# Altium schematic sheet Multiplexage_Matrices.SchDoc
size A3; Author: Jérémie Jean-Elie; Organization: ETML-ES; Address1: Avenue Recordon 1; Address2: 1004 Lausanne; Address3: Switzerland; Revision: 1; SheetNumber: 3; SheetTotal: 7; Version: E
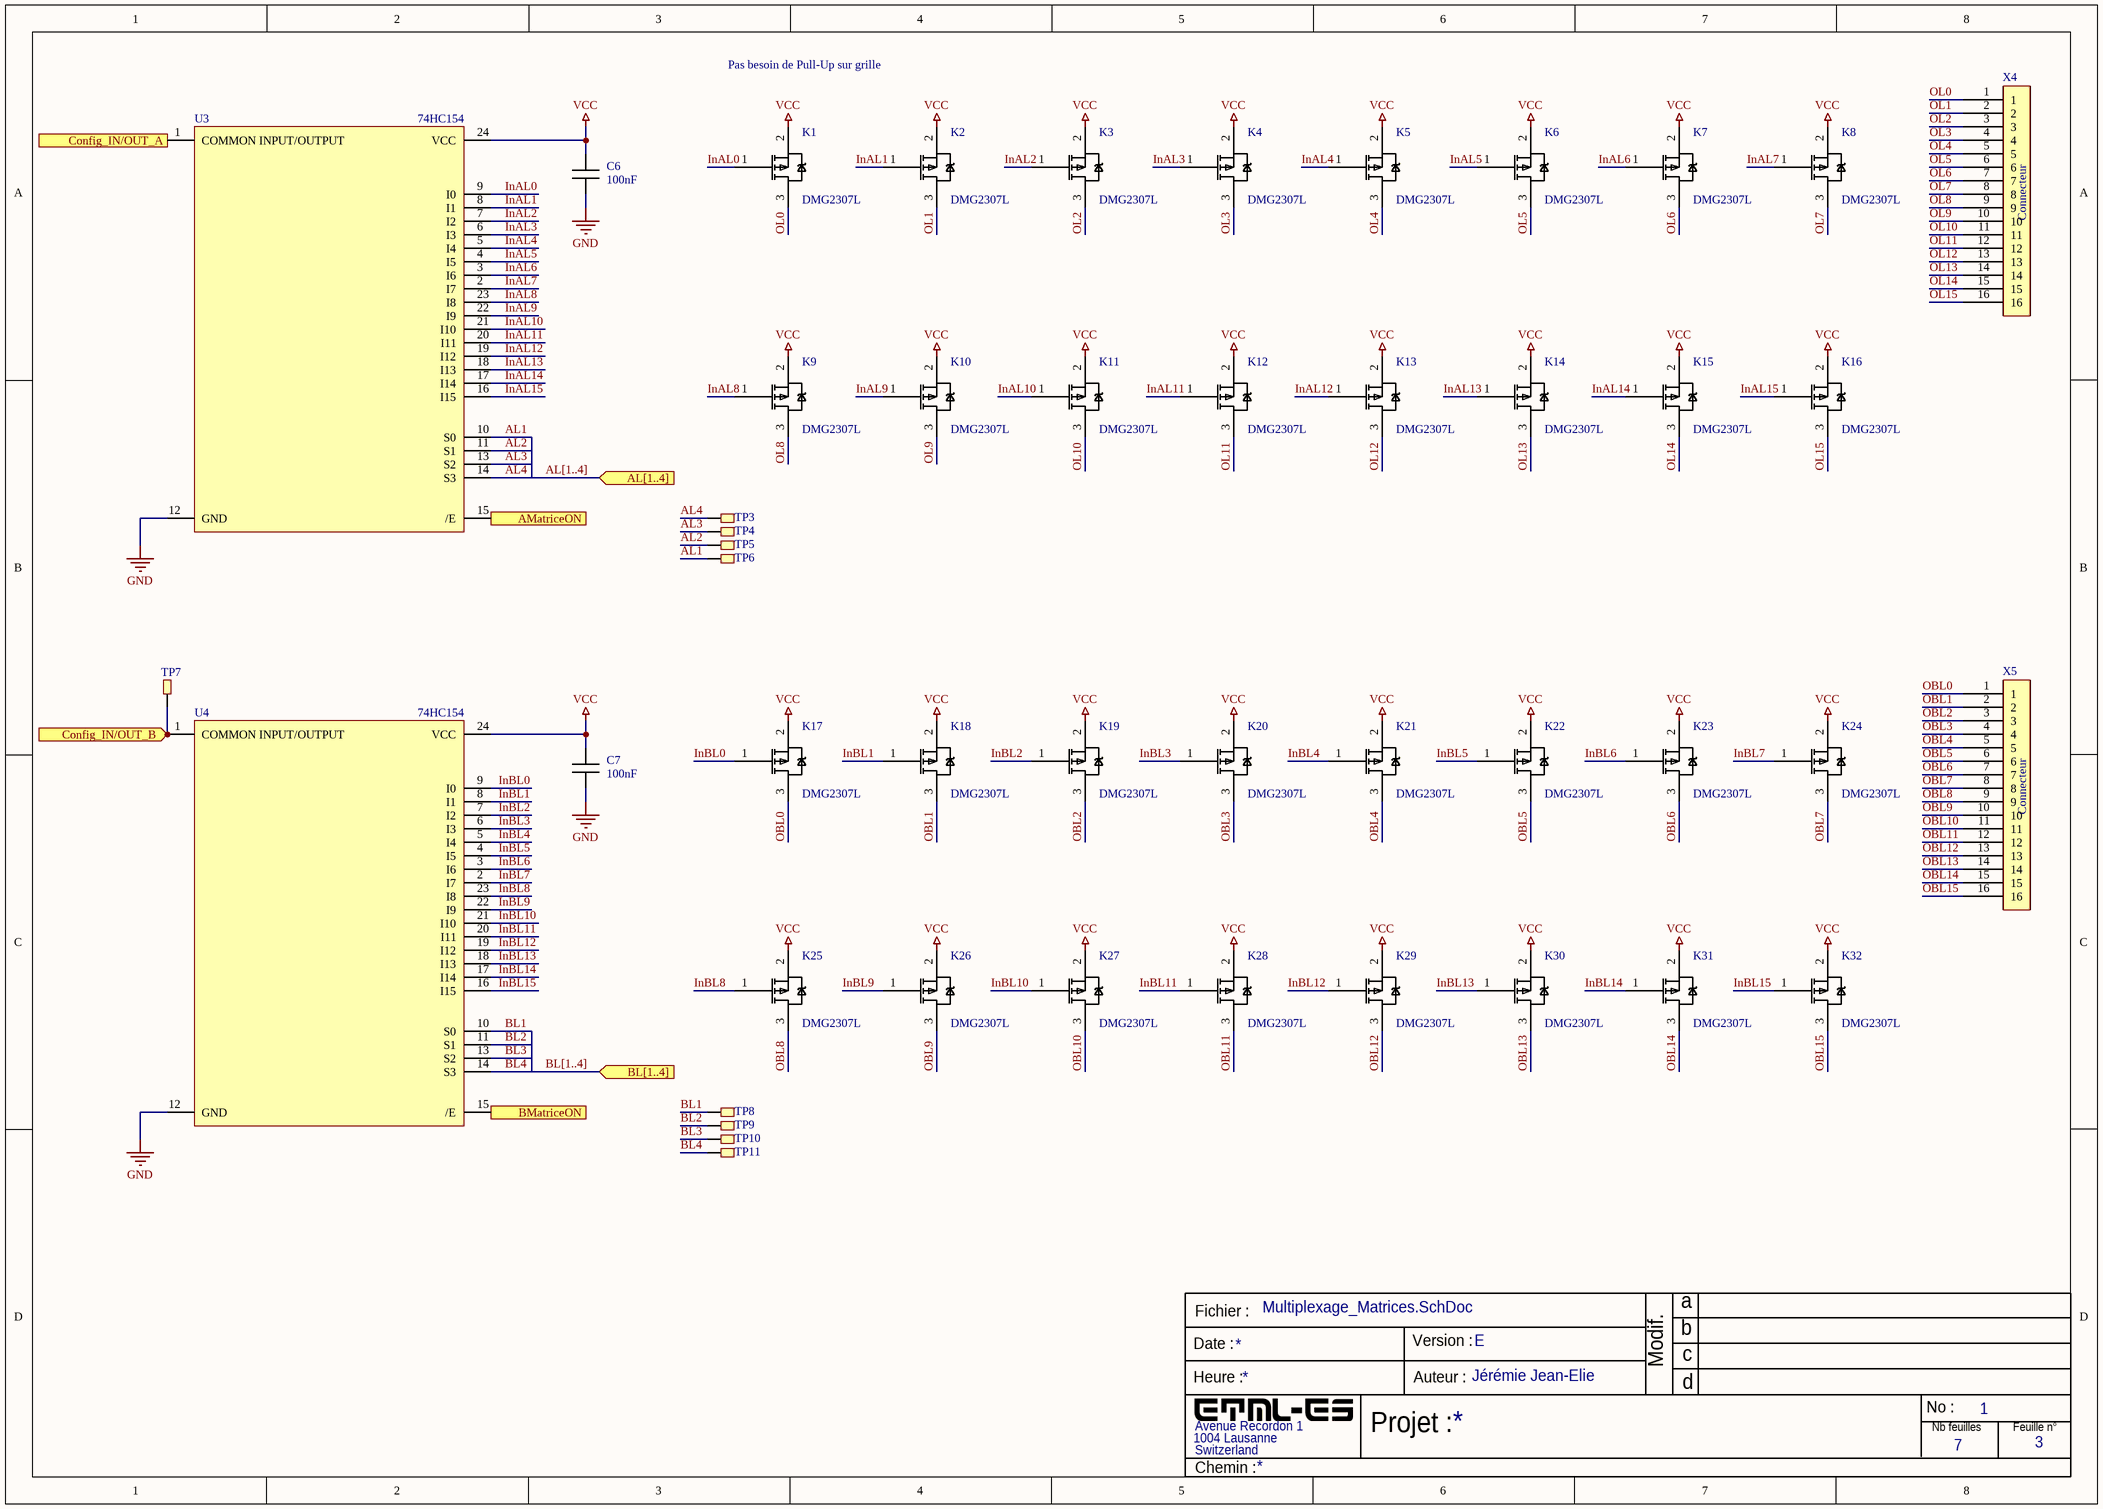
[diagram p0: Multiplexage_Matrices.SchDoc]

## Parts
C6  100nF  [CAPC1608X08M]
C7  100nF  [CAPC1608X08M]
K1  DMG2307L  [SOT90P240X110-3M]
K2  DMG2307L  [SOT90P240X110-3M]
K3  DMG2307L  [SOT90P240X110-3M]
K4  DMG2307L  [SOT90P240X110-3M]
K5  DMG2307L  [SOT90P240X110-3M]
K6  DMG2307L  [SOT90P240X110-3M]
K7  DMG2307L  [SOT90P240X110-3M]
K8  DMG2307L  [SOT90P240X110-3M]
K9  DMG2307L  [SOT90P240X110-3M]
K10  DMG2307L  [SOT90P240X110-3M]
K11  DMG2307L  [SOT90P240X110-3M]
K12  DMG2307L  [SOT90P240X110-3M]
K13  DMG2307L  [SOT90P240X110-3M]
K14  DMG2307L  [SOT90P240X110-3M]
K15  DMG2307L  [SOT90P240X110-3M]
K16  DMG2307L  [SOT90P240X110-3M]
K17  DMG2307L  [SOT90P240X110-3M]
K18  DMG2307L  [SOT90P240X110-3M]
K19  DMG2307L  [SOT90P240X110-3M]
K20  DMG2307L  [SOT90P240X110-3M]
K21  DMG2307L  [SOT90P240X110-3M]
K22  DMG2307L  [SOT90P240X110-3M]
K23  DMG2307L  [SOT90P240X110-3M]
K24  DMG2307L  [SOT90P240X110-3M]
K25  DMG2307L  [SOT90P240X110-3M]
K26  DMG2307L  [SOT90P240X110-3M]
K27  DMG2307L  [SOT90P240X110-3M]
K28  DMG2307L  [SOT90P240X110-3M]
K29  DMG2307L  [SOT90P240X110-3M]
K30  DMG2307L  [SOT90P240X110-3M]
K31  DMG2307L  [SOT90P240X110-3M]
K32  DMG2307L  [SOT90P240X110-3M]
TP3  TestPoint  [KEYSTONE_5019]  (value not drawn)
TP4  TestPoint  [KEYSTONE_5019]  (value not drawn)
TP5  TestPoint  [KEYSTONE_5019]  (value not drawn)
TP6  TestPoint  [KEYSTONE_5019]  (value not drawn)
TP7  5019  [KEYSTONE_5019]  (value not drawn)
TP8  TestPoint  [KEYSTONE_5019]  (value not drawn)
TP9  TestPoint  [KEYSTONE_5019]  (value not drawn)
TP10  TestPoint  [KEYSTONE_5019]  (value not drawn)
TP11  TestPoint  [KEYSTONE_5019]  (value not drawn)
U3  74HC154  [SOP127P1030X265-24N]
U4  74HC154  [SOP127P1030X265-24N]
X4  (no value)  [MOLEX_2x8]
X5  (no value)  [MOLEX_2x8]

## Ports
AL[1..4] (in, see Schema_bloc[2B], Microcontroleur[1B]), AMatriceON (in, see Schema_bloc[2C], Microcontroleur[1C]), BL[1..4] (in, see Schema_bloc[2B], Microcontroleur[1B]), BMatriceON (in, see Schema_bloc[2C], Microcontroleur[1C]), Config_IN/OUT_A (in, see Schema_bloc[2B], Microcontroleur[1B]), Config_IN/OUT_B (in, see Schema_bloc[2C], Microcontroleur[1C])

## Nets
GND: C6.1 C7.1 U3.12(GND) U4.12(GND)
VCC: C6.2 C7.2 K1.2(S) K2.2(S) K3.2(S) K4.2(S) K5.2(S) K6.2(S) K7.2(S) K8.2(S) K9.2(S) K10.2(S) K11.2(S) K12.2(S) K13.2(S) K14.2(S) K15.2(S) K16.2(S) K17.2(S) K18.2(S) K19.2(S) K20.2(S) K21.2(S) K22.2(S) K23.2(S) K24.2(S) K25.2(S) K26.2(S) K27.2(S) K28.2(S) K29.2(S) K30.2(S) K31.2(S) K32.2(S) U3.24(VCC) U4.24(VCC)
AL1: TP6.1 U3.10(S0)
AL2: TP5.1 U3.11(S1)
AL3: TP4.1 U3.13(S2)
AL4: TP3.1 U3.14(S3)
AMatriceON: U3.15(/E) ; port AMatriceON
BL1: TP8.1 U4.10(S0)
BL2: TP9.1 U4.11(S1)
BL3: TP10.1 U4.13(S2)
BL4: TP11.1 U4.14(S3)
BMatriceON: U4.15(/E) ; port BMatriceON
Config_IN/OUT_A: U3.1(COMMON_INPUT/OUTPUT) ; port Config_IN/OUT_A
Config_IN/OUT_B: TP7.1 U4.1(COMMON_INPUT/OUTPUT) ; port Config_IN/OUT_B
InAL0: K1.1(G) U3.9(I0)
InAL1: K2.1(G) U3.8(I1)
InAL2: K3.1(G) U3.7(I2)
InAL3: K4.1(G) U3.6(I3)
InAL4: K5.1(G) U3.5(I4)
InAL5: K6.1(G) U3.4(I5)
InAL6: K7.1(G) U3.3(I6)
InAL7: K8.1(G) U3.2(I7)
InAL8: K9.1(G) U3.23(I8)
InAL9: K10.1(G) U3.22(I9)
InAL10: K11.1(G) U3.21(I10)
InAL11: K12.1(G) U3.20(I11)
InAL12: K13.1(G) U3.19(I12)
InAL13: K14.1(G) U3.18(I13)
InAL14: K15.1(G) U3.17(I14)
InAL15: K16.1(G) U3.16(I15)
InBL0: K17.1(G) U4.9(I0)
InBL1: K18.1(G) U4.8(I1)
InBL2: K19.1(G) U4.7(I2)
InBL3: K20.1(G) U4.6(I3)
InBL4: K21.1(G) U4.5(I4)
InBL5: K22.1(G) U4.4(I5)
InBL6: K23.1(G) U4.3(I6)
InBL7: K24.1(G) U4.2(I7)
InBL8: K25.1(G) U4.23(I8)
InBL9: K26.1(G) U4.22(I9)
InBL10: K27.1(G) U4.21(I10)
InBL11: K28.1(G) U4.20(I11)
InBL12: K29.1(G) U4.19(I12)
InBL13: K30.1(G) U4.18(I13)
InBL14: K31.1(G) U4.17(I14)
InBL15: K32.1(G) U4.16(I15)
OBL0: K17.3(D) X5.1
OBL1: K18.3(D) X5.2
OBL2: K19.3(D) X5.3
OBL3: K20.3(D) X5.4
OBL4: K21.3(D) X5.5
OBL5: K22.3(D) X5.6
OBL6: K23.3(D) X5.7
OBL7: K24.3(D) X5.8
OBL8: K25.3(D) X5.9
OBL9: K26.3(D) X5.10
OBL10: K27.3(D) X5.11
OBL11: K28.3(D) X5.12
OBL12: K29.3(D) X5.13
OBL13: K30.3(D) X5.14
OBL14: K31.3(D) X5.15
OBL15: K32.3(D) X5.16
OL0: K1.3(D) X4.1
OL1: K2.3(D) X4.2
OL2: K3.3(D) X4.3
OL3: K4.3(D) X4.4
OL4: K5.3(D) X4.5
OL5: K6.3(D) X4.6
OL6: K7.3(D) X4.7
OL7: K8.3(D) X4.8
OL8: K9.3(D) X4.9
OL9: K10.3(D) X4.10
OL10: K11.3(D) X4.11
OL11: K12.3(D) X4.12
OL12: K13.3(D) X4.13
OL13: K14.3(D) X4.14
OL14: K15.3(D) X4.15
OL15: K16.3(D) X4.16

## Buses and harness runs
bus AL[1..4] = port AL[1..4]
bus BL[1..4] = port BL[1..4]

## Notes on the sheet
- Pas besoin de Pull-Up sur grille
- Fichier :
- a
- Date :
- Heure :
- Version :
- Auteur :
- Modif.
- b
- c
- d
- Projet :
- No :
- Nb feuilles
- Feuille n°
- Chemin :
- (in symbol Mâle DIN 8 x 8) Connecteur

## Library data of the parts
C6 C7 = CMP-065-000000-2: CAPC 100nF X7R 50V 10% 1608 (0603 INCH); Manufacturer: TDK; Manufacturer Number: CGA3E2X7R1H104K080AA; IsStocked: 1; PN: PN-338083; Current: NULL; TemperatureRange: -55°C to +125°C; Voltage: 50V; Dielectric: X7R; Value: 100nF; Category: Passives; Supplier Price 1: 0.0100; Supplier Part Number 1: FAB.0603_C 100n; SubCategory: Condensateurs ceramique; Tolerance: ±10%; Supplier 1: ETML; TemperatureCoeff: NULL; Power: NULL
K1-K32 = CMP-056-000002-3: TRAN DMG2307L P-Channel Enhancement MOSFET 30V 2.5A; Manufacturer: Diodes Incorporated; IsStocked: 0; TemperatureRange: -55°C to +150°C; Power: 760mW; PN: PN-317407; SubCategory: Transistors; Manufacturer Number: DMG2307L; Supplier Part Number 1: 2061518; Supplier 1: Farnell; Category: DiscreteSemiconductors; Current: 2.5A; Supplier Price 1: 0.1060; Voltage: 30V; Value: DMG2307L
TP7 = TestPoint
X4 X5 = Mâle DIN 8 x 8
U3 U4 = 74HC154: Supplier 1: DigiKey; Supplier Part Number 1: 296-24352-1-ND